# Altium project Amplified Modulator.PRJPCB
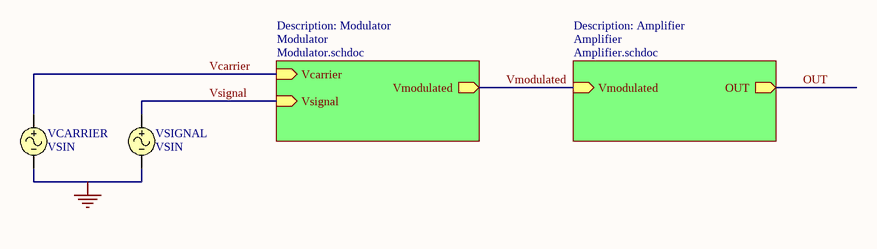
[diagram p0: Amplified Modulator.schdoc]
2 sheets, 11 parts. Net scope: hierarchical (ports join the sheet entries above them; power ports are global).
Sheets:
  Amplified Modulator.schdoc
    Modulator = Modulator.schdoc

## Sheet Amplified Modulator.schdoc: Amplified Modulator
size A4; Organization: Altium Limited; Address1: L3, 12a Rodborough Rd; Address2: Frenchs Forest; Address3: NSW; Address4: Australia 2086; DocumentNumber: 1; SheetNumber: 1; SheetTotal: 3

### Parts
VCARRIER  VSIN
VSIGNAL  VSIN

### Sub-sheets
Amplifier = Amplifier.schdoc (file not in this document): Vmodulated (in), OUT (out)  | Description: Amplifier
Modulator = Modulator.schdoc: Vmodulated (out), Vcarrier (in), Vsignal (in)  | Description: Modulator

### Nets
GND: VCARRIER.2 VSIGNAL.2
OUT: sheet Amplifier/OUT
Vcarrier: VCARRIER.1 ; sheet Modulator/Vcarrier
Vmodulated: sheet Amplifier/Vmodulated, sheet Modulator/Vmodulated
Vsignal: VSIGNAL.1 ; sheet Modulator/Vsignal

### Notes on the sheet
- Title
- Size:
- Date:
- A4
- Number:
- Time:
- Revision:
- Sheet
- of
- File:

### Library data of the parts
VCARRIER VSIGNAL = VSIN: Sinusoidal Voltage Source

## Sheet Modulator.schdoc: Modulator
size A4; Organization: Altium Limited; Address1: L3, 12a Rodborough Rd; Address2: Frenchs Forest; Address3: NSW; Address4: Australia 2086; DocumentNumber: 3; SheetNumber: 3; SheetTotal: 3
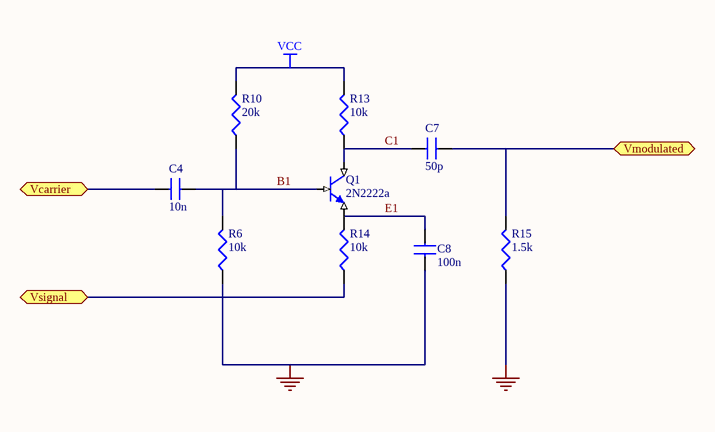
[diagram p1: Modulator.schdoc]

### Parts
C4  10n
C7  50p
C8  100n
Q1  2N2222a
R6  10k
R10  20k
R13  10k
R14  10k
R15  1.5k

### Ports
Vcarrier, Vmodulated, Vsignal

### Nets
GND: C8.1 R6.2(BOT) R15.2(BOT)
VCC: R10.1(TOP) R13.1(TOP)
B1: C4.2 Q1.2(B) R6.1(TOP) R10.2(BOT)
C1: C7.1 Q1.1(C) R13.2(BOT)
E1: C8.2 Q1.3(E) R14.1(TOP)
Vcarrier: C4.1 ; port Vcarrier
Vmodulated: C7.2 R15.1(TOP) ; port Vmodulated
Vsignal: R14.2(BOT) ; port Vsignal

### Notes on the sheet
- Title
- Size:
- Date:
- A4
- Number:
- Time:
- Revision:
- Sheet
- of
- File:

### Library data of the parts
C4 C7 C8 = CAP: Capacitor
  C4: Value: 10n
  C7: Value: 50p
  C8: Value: 100n
Q1 = 2N2222a: NPN BJT
R6 R10 R13-R15 = RES: Resistor
  R6 R13 R14: Value: 10k
  R10: Value: 20k
  R15: Value: 1.5k

## Nets that join several sheets
GND: Amplified Modulator (VCARRIER.2 VSIGNAL.2), Modulator (C8.1 R6.2 R15.2)
Vcarrier: Amplified Modulator (VCARRIER.1), Modulator (C4.1)
Vsignal: Amplified Modulator (VSIGNAL.1), Modulator (R14.2)